# EAGLE board VCFA_v2 (EAGLE 9.4.2)
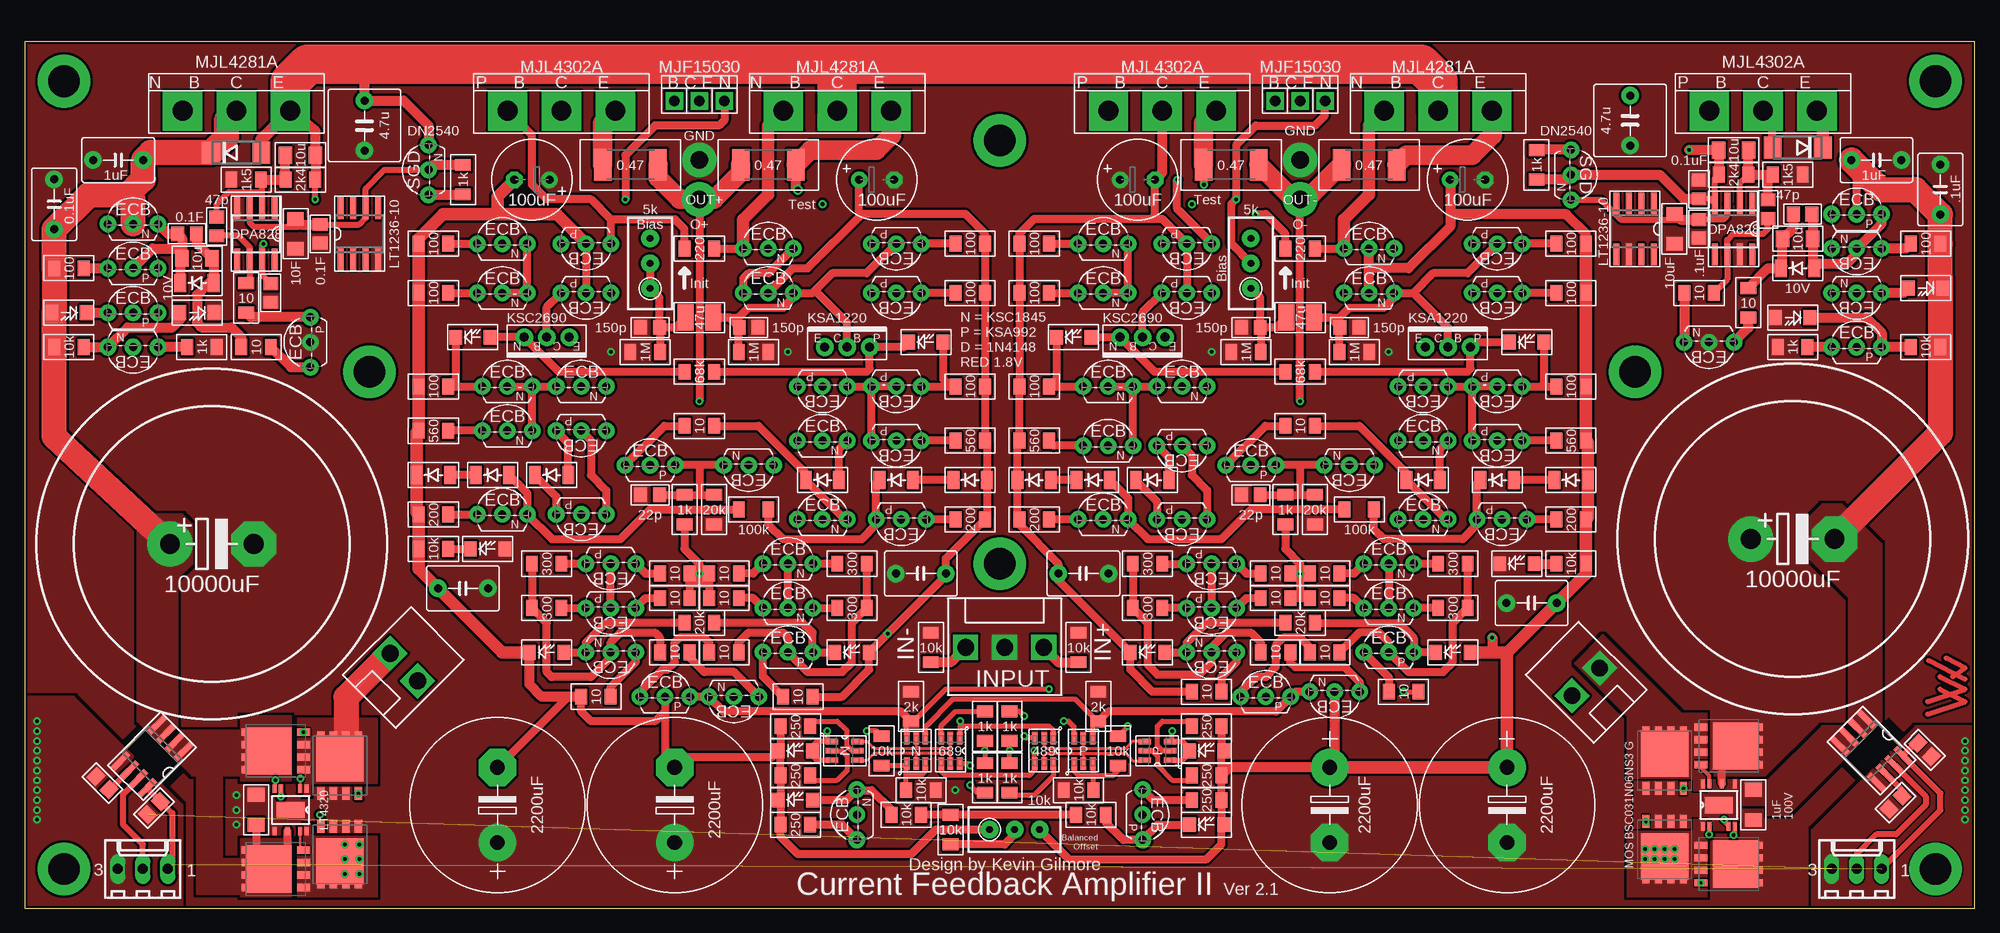
[diagram p4: board, top side]
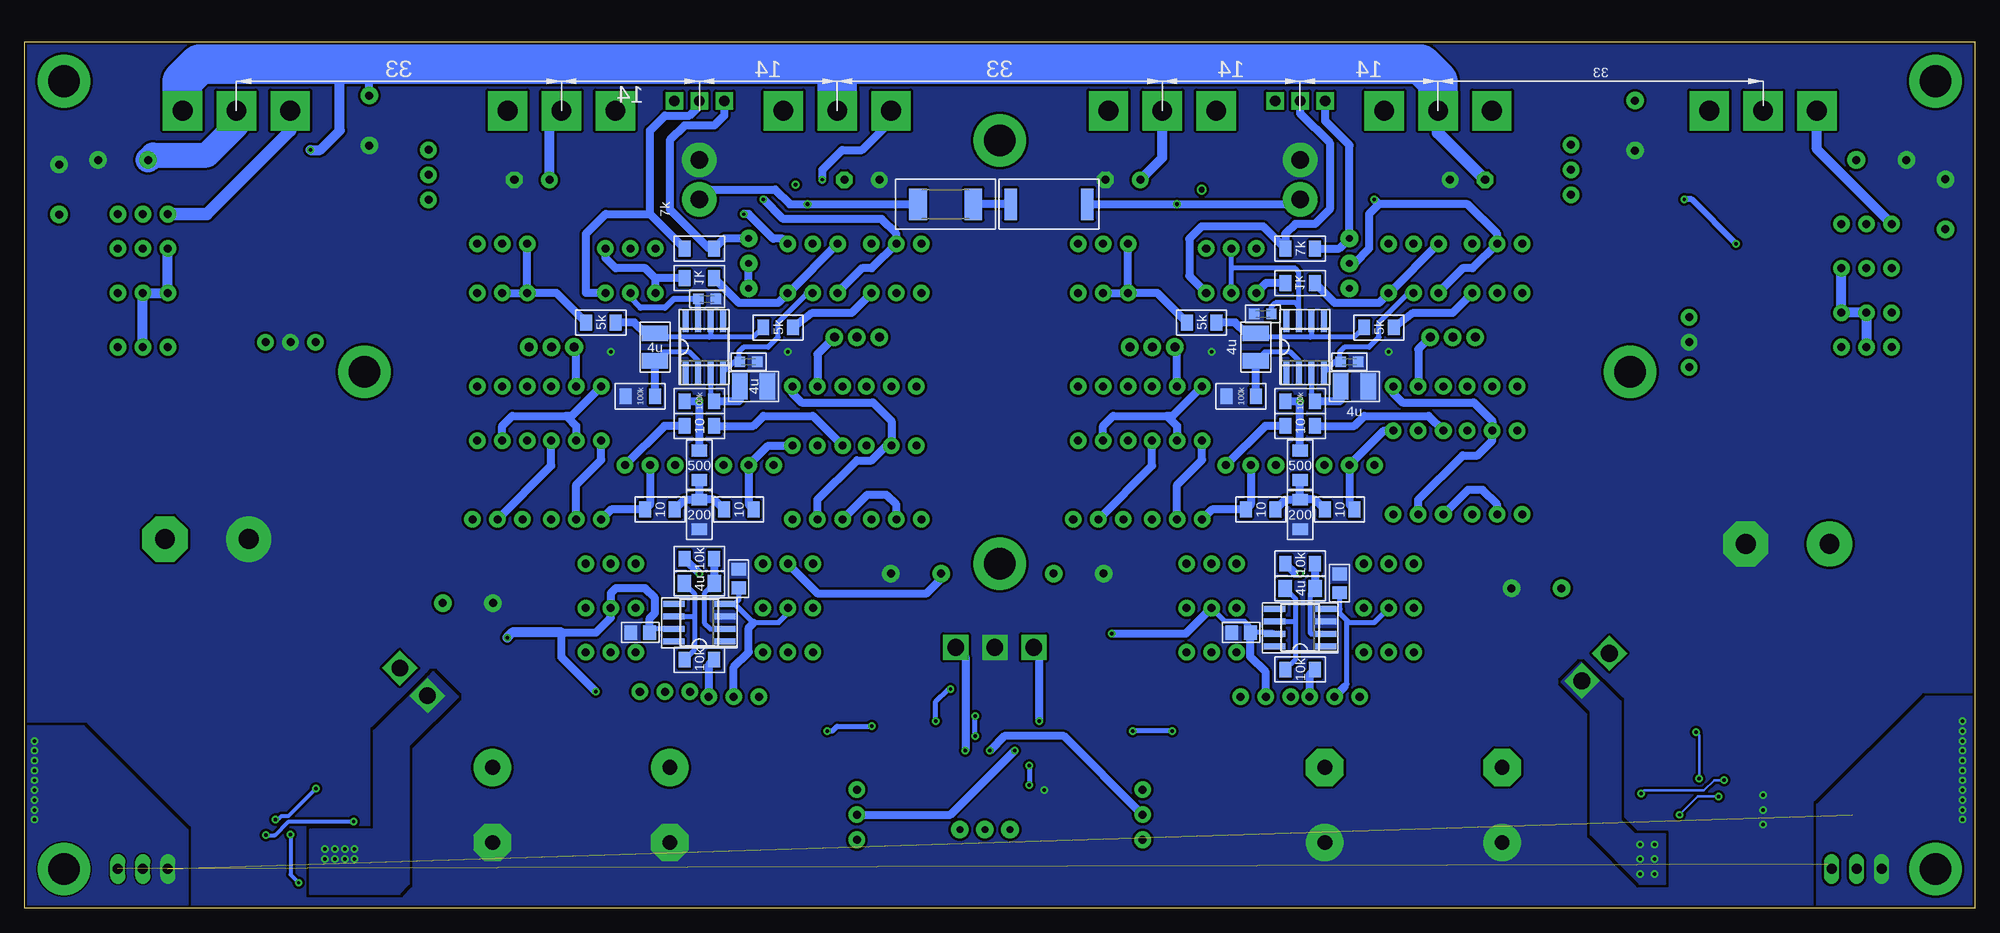
[diagram p5: board, bottom side, seen from below]

Size 198 x 88 mm. Coordinates in mm from the lower left corner, seen from the top.
Outline: 0,0 198,0 198,88 0,88 0,0
Copper layers (1*16): Top 0.035mm / dielectric 1.5mm / Bottom 0.035mm
Design rules "default *": minimum track width 6mil, minimum drill 0.35mm, track to track 6mil, track to pad 6mil, pad to pad 6mil, via to via 6mil, smd to smd 0mil, copper to edge 10mil, drill to drill 6mil, minimum pad ring 10mil, minimum via ring 8mil, stop-mask expansion 4mil, vias tented up to drill 0.35mm, thermal gap 3mil

## Footprints (pad centres in the part's own frame; a part is rotated, then mirrored left to right if it is on the bottom)
ECHU-Y = smd 1.277 x 3.2: 1 -3.9,0; 2 3.9,0
C0805 = smd 1.3 x 1.5: 1 -0.95,0; 2 0.95,0
E7,5-18 = drill 1.5 pad 3.81: + -3.81,0 | drill 1.5 pad 3.81 octagon: - 3.81,0
C050-045X075 = drill 0.813 pad 1.778: 1 -2.54,0; 2 2.54,0
C1206 = smd 1.4 x 1.7: 1 -1.527,0; 2 1.527,0
C1210 = smd 1.6 x 2.7: 1 -1.4,0; 2 1.4,0
C0603K = smd 1.05 x 1.08: 1 -0.875,0; 2 0.875,0
E3,5-8 = drill 0.813 pad 1.676: + -1.778,0 | drill 0.813 pad 1.676 octagon: - 1.778,0
EB35D-8.5 = drill 2.007 pad 4.597: + -4.25,0 | drill 2.007 pad 4.597 octagon: - 4.25,0
C050-075X075 = drill 0.813 pad 1.778: 1 -2.54,0; 2 2.54,0
SOD80C = smd 1.2 x 1.8: A 1.7,0; C -1.7,0
DO214AA = smd 1.8 x 2.2: A 2.55,0; C -2.55,0
SO8 = smd 0.6 x 2.2: 1 -1.905,-2.6; 2 -0.635,-2.6; 3 0.635,-2.6; 4 1.905,-2.6; 5 1.905,2.6; 6 0.635,2.6; 7 -0.635,2.6; 8 -1.905,2.6
M3_HOLE = drill 3.2 pad 5.334: P$1 0,0
SOIC8 = smd 0.6 x 2.2: 1 -1.905,-2.6; 2 -0.635,-2.6; 3 0.635,-2.6; 4 1.905,-2.6; 5 1.905,2.6; 6 0.635,2.6; 7 -0.635,2.6; 8 -1.905,2.6
6410-03 = drill 1.016 long: 1 2.54,0; 2 0,0; 3 -2.54,0
LED_SML1206 = smd 1.3 x 1.5: A 1.75,0; C -1.75,0
PAD-16 = drill 1.8 pad 3.5: P$1 0,0
SOT-23-6 = smd 1.27 x 0.559: 1 -1.295,0.95; 2 -1.295,0; 3 -1.295,-0.95; 4 1.295,-0.95; 5 1.295,0; 6 1.295,0.95
TRANSISTOR_TO92-ECB_P = drill 0.813 pad 1.676: B 2.54,0; C 0,0; E -2.54,0
TRANSISTOR_TO92-ECB_N = drill 0.813 pad 1.676: B 2.54,0; C 0,0; E -2.54,0
TRANSISTOR_TO126_P = drill 0.9 pad 1.778: B 2.286,0; C 0,0; E -2.286,0
TRANSISTOR_TO126_N = drill 0.9 pad 1.778: B 2.286,0; C 0,0; E -2.286,0
TRANSISTOR_TO220_BCE_N = drill 1.1 pad 1.778 square: B -2.54,0; C 0,0; E 2.54,0
TRANSISTOR_TO247_BCE_N = drill 2 pad 4 square: B -5.461,0; C 0,0; E 5.461,0
TRANSISTOR_TO247_BCE_P = drill 2 pad 4 square: B -5.461,0; C 0,0; E 5.461,0
TRANSISTOR_TO92-SGD_N = drill 0.813 pad 1.676: D 2.54,0; G 0,0; S -2.54,0
PG-TDSON-8 = smd 1.3 x 0.75: 1 -2.825,1.905; 2 -2.825,0.635; 3 -2.825,-0.635; 4 -2.825,-1.905; 5 2.825,-1.905; 6 2.825,-0.635; 7 2.825,0.635; 8 2.825,1.905 | smd 4.7 x 4.8: TH 0.725,0
RTRIM3296W = drill 0.7 pad 1.778: 1 0,-2.54; 2 0,0; 3 0,2.54
MINI_MELF-0204W = smd 1.2 x 1.6: 1 -1.5,0; 2 1.5,0
R2512 = smd 1.8 x 3.2: 1 -2.8,0; 2 2.8,0
LT4320_MSOP = smd 0.9 x 0.42: 1 -2.163,1.625; 2 -2.163,0.975; 5 -2.163,-0.975; 6 -2.163,-1.625; 7 2.15,-1.625; 9 2.15,-0.325; 11 2.15,0.975; 12 2.15,1.625 | smd 1.65 x 2.85: EXP 0,0
KK-156-3 = drill 1.7 pad 2.54 square: 1 -3.96,0; 2 0,0; 3 3.96,0
KK-156-2 = drill 1.7 pad 2.54 square: 1 -1.98,0; 2 1.98,0

## Placement (x,y rotation side)
C1  [ECHU-Y]  94,71.5 180 bottom
C3  0.1uF  [C0805]  74.5,28 0 bottom
C4  0.1uF  [C0805]  64.5,33 90 bottom
C5  1000uF  [E7,5-18]  132.5,10.5 270 top
C6  1000uF  [E7,5-18]  48,10.5 90 top
C7  1000uF  [E7,5-18]  150.5,10.5 270 top
C8  1000uF  [E7,5-18]  66,10.5 90 top
C9  0.1uF  [C050-045X075]  91,34 180 top
C10  0.1uF  [C050-045X075]  107.5,34 180 top
C11  0.1uF  [C050-045X075]  153,31 180 top
C12  0.1uF  [C050-045X075]  44.5,32.5 180 top
C13  10uF  [C1206]  68.5,32.5 0 bottom
C14  0.1uF  [C0805]  135.5,28 0 bottom
C15  0.1uF  [C0805]  125.5,33.5 90 bottom
C16  10uF  [C1206]  129.5,33 0 bottom
C17  22p  [C0805]  63.5,42 180 top
C18  47u  [C1210]  68.5,60 180 top
C19  150p  [C0805]  73.5,59 180 top
C20  150p  [C0805]  63.5,59 180 top
C21  4.7uF  [C1210]  73,57 270 bottom
C22  4.7uF  [C1210]  63,53 180 bottom
C23  0.1uF  [C0603K]  72.29,60.36 180 bottom
C24  0.1uF  [C0603K]  63.5,55.5 180 bottom
C25  100uF  [E3,5-8]  86.5,74 0 top
C26  100uF  [E3,5-8]  51.5,74 180 top
C27  22p  [C0805]  124.5,42 180 top
C28  47u  [C1210]  129.5,60 180 top
C29  150p  [C0805]  134.5,59 180 top
C30  150p  [C0805]  124.5,59 180 top
C31  4.7uF  [C1210]  134,57 270 bottom
C32  4.7uF  [C1210]  124,53 180 bottom
C33  0.1uF  [C0603K]  128.71,61.89 0 bottom
C34  0.1uF  [C0603K]  124.5,55.5 180 bottom
C35  100uF  [E3,5-8]  146.5,74 0 top
C36  100uF  [E3,5-8]  113,74 0 top
C37  10000uF  [EB35D-8.5]  19,37 0 top
C38  10000uF  [EB35D-8.5]  179.5,37.5 0 top
C39  0.1uF  [C050-045X075]  188,76 0 top
C40  10uF  [C1206]  17.5,66 0 top
C41  10uF  [C1206]  180,68 0 top
C42  0.1uF  [C050-045X075]  9.5,76 0 top
C43  0.1uF  [C0805]  16.5,68.5 0 top
C44  0.1uF  [C0805]  180.5,70.5 0 top
C45  0.1uF  [C0805]  25,62.5 90 top
C46  0.1uF  [C0805]  170,73 90 top
C47  10uF  [C1206]  27.5,68.5 270 top
C48  10uF  [C1206]  167.5,69 90 top
C49  0.1uF  [C0805]  30,68.5 270 top
C50  0.1uF  [C0805]  170,69 90 top
C51  47p  [C0805]  19.5,69.25 90 top
C52  47p  [C0805]  177,71 90 top
C53  10uF  [C1206]  28,76.5 180 top
C54  10uF  [C1206]  173.5,77 180 top
C55  4.7uF  [C050-075X075]  34.5,79.5 90 top
C56  4.7uF  [C050-075X075]  163,80 270 top
C57  47uF  [C1206]  23.5,10 90 top
C58  0.1uF  [C050-045X075]  3,71.5 270 top
C59  47uF  [C1206]  175.5,10.5 90 top
C60  0.1uF  [C050-045X075]  194.5,73 90 top
C61  [C0805]  13.13,10.18 225 top
C62  [C0805]  189.95,10.73 225 top
C63  1n  [C0805]  7.91,12.73 135 top
C64  [C0805]  192.9,16.09 315 top
D1  LL4148  [SOD80C]  96,43.5 0 top
D2  LL4148  [SOD80C]  88.5,43.5 0 top
D3  LL4148  [SOD80C]  47.5,44 0 top
D4  LL4148  [SOD80C]  41.5,44 0 top
D5  LL4148  [SOD80C]  81,43.5 0 top
D6  LL4148  [SOD80C]  53.5,44 0 top
D7  LL4148  [SOD80C]  157,43.5 0 top
D8  LL4148  [SOD80C]  149.5,43.5 0 top
D9  LL4148  [SOD80C]  108.5,43.5 0 top
D10  LL4148  [SOD80C]  102.5,43.5 0 top
D11  LL4148  [SOD80C]  142,43.5 0 top
D12  LL4148  [SOD80C]  114.5,43.5 0 top
D13  BZT55B10  [SOD80C]  17.5,63.5 0 top
D14  BZT55B10  [SOD80C]  180,65 0 top
D15  S1G  [DO214AA]  21.5,76.75 0 top
D16  S1G  [DO214AA]  180,77.25 180 top
D17  LT1236-10  [SO8]  34,68.5 0 top
D18  LT1236-10  [SO8]  163.5,69 180 top
H1  HOLE  [M3_HOLE]  4,4 0 top
H2  HOLE  [M3_HOLE]  194,4 0 top
H3  HOLE  [M3_HOLE]  4,84 0 bottom
H4  HOLE  [M3_HOLE]  194,84 0 top
H5  HOLE  [M3_HOLE]  35,54.5 0 top
H6  HOLE  [M3_HOLE]  99,35 0 top
H7  HOLE  [M3_HOLE]  163.5,54.5 0 top
H8  HOLE  [M3_HOLE]  99,78 0 top
IC1  LTC2057HV  [SOIC8]  68.5,28.5 90 bottom
IC2  LTC2057HV  [SOIC8]  129.5,29 90 bottom
IC3  LTC2057HV  [SOIC8]  68,57 0 bottom
IC4  LTC2057HV  [SOIC8]  129,57 0 bottom
IC5  OPA827  [SOIC8]  173.5,69 180 top
IC6  OPA827  [SOIC8]  23.5,68.5 180 top
J1  22-27-2031-03  [6410-03]  12,4 0 top
J2  22-27-2031-03  [6410-03]  186,4 0 top
LED1  RED  [LED_SML1206]  120,8.5 0 top
LED2  RED  [LED_SML1206]  78.25,11 0 top
LED3  RED  [LED_SML1206]  120,16 0 top
LED4  RED  [LED_SML1206]  78.25,16 0 top
LED5  RED  [LED_SML1206]  84,26 0 top
LED6  RED  [LED_SML1206]  53,26 0 top
LED7  RED  [LED_SML1206]  145,26 0 top
LED8  RED  [LED_SML1206]  114,26 0 top
LED9  RED  [LED_SML1206]  91.5,57.5 0 top
LED10  RED  [LED_SML1206]  45.5,58 0 top
LED11  RED  [LED_SML1206]  152.5,57.5 0 top
LED12  RED  [LED_SML1206]  106.5,58 0 top
LED13  RED  [LED_SML1206]  17.5,60.5 180 top
LED14  RED  [LED_SML1206]  179.5,60 180 top
LED15  RED  [LED_SML1206]  4.5,60.5 180 top
LED16  RED  [LED_SML1206]  193,63 180 top
LED17  RED  [LED_SML1206]  151.5,35 0 top
LED18  RED  [LED_SML1206]  47,36.5 0 top
PAD1  PAD  [PAD-16]  68.5,72 0 top
PAD2  PAD  [PAD-16]  129.5,72 0 top
PAD3  PAD  [PAD-16]  129.5,76 0 top
PAD4  PAD  [PAD-16]  68.5,76 0 top
Q1  LSK689  [SOT-23-6]  94,16 270 top
Q2  KSA992  [TRANSISTOR_TO92-ECB_P]  113.5,9.5 270 top
Q3  KSC1845  [TRANSISTOR_TO92-ECB_N]  84.5,9.5 90 top
Q4  LSK489  [SOT-23-6]  103.5,16 270 top
Q5  LS3550  [SOT-23-6]  107.5,16 90 top
Q6  LS3250  [SOT-23-6]  90.5,16 90 top
Q7  LS3250  [SOT-23-6]  83.25,16 0 top
Q8  LS3550  [SOT-23-6]  115,16 180 top
Q9  KSC1845  [TRANSISTOR_TO92-ECB_N]  72,21.5 180 top
Q10  KSA992  [TRANSISTOR_TO92-ECB_P]  65,21.5 0 top
Q11  KSA992  [TRANSISTOR_TO92-ECB_P]  77.5,26 0 top
Q12  KSC1845  [TRANSISTOR_TO92-ECB_N]  59.5,26 180 top
Q13  KSC1845  [TRANSISTOR_TO92-ECB_N]  77.5,35 0 top
Q14  KSA992  [TRANSISTOR_TO92-ECB_P]  59.5,35 180 top
Q15  KSC1845  [TRANSISTOR_TO92-ECB_N]  77.5,30.5 0 top
Q16  KSA992  [TRANSISTOR_TO92-ECB_P]  59.5,30.5 180 top
Q17  KSC1845  [TRANSISTOR_TO92-ECB_N]  133,22 180 top
Q18  KSA992  [TRANSISTOR_TO92-ECB_P]  126,21.5 0 top
Q19  KSA992  [TRANSISTOR_TO92-ECB_P]  138.5,26 0 top
Q20  KSC1845  [TRANSISTOR_TO92-ECB_N]  120.5,26 180 top
Q21  KSC1845  [TRANSISTOR_TO92-ECB_N]  138.5,35 0 top
Q22  KSA992  [TRANSISTOR_TO92-ECB_P]  120.5,35 180 top
Q23  KSC1845  [TRANSISTOR_TO92-ECB_N]  138.5,30.5 0 top
Q24  KSA992  [TRANSISTOR_TO92-ECB_P]  120.5,30.5 180 top
Q25  KSA992  [TRANSISTOR_TO92-ECB_P]  89,39.5 180 top
Q26  KSA992  [TRANSISTOR_TO92-ECB_P]  63.5,45 0 top
Q27  KSC1845  [TRANSISTOR_TO92-ECB_N]  73.5,45 180 top
Q28  KSC1845  [TRANSISTOR_TO92-ECB_N]  48.5,40 0 top
Q29  KSC1845  [TRANSISTOR_TO92-ECB_N]  81,47.5 0 top
Q30  KSC1845  [TRANSISTOR_TO92-ECB_N]  81,39.5 0 top
Q31  KSA992  [TRANSISTOR_TO92-ECB_P]  56.5,48.5 180 top
Q32  KSA992  [TRANSISTOR_TO92-ECB_P]  56.5,40 180 top
Q33  KSA992  [TRANSISTOR_TO92-ECB_P]  88.5,47.5 180 top
Q34  KSC1845  [TRANSISTOR_TO92-ECB_N]  49,48.5 0 top
Q35  KSA992  [TRANSISTOR_TO92-ECB_P]  88.5,53 180 top
Q36  KSA992  [TRANSISTOR_TO92-ECB_P]  81,53 180 top
Q37  KSC1845  [TRANSISTOR_TO92-ECB_N]  56.5,53 0 top
Q38  KSC1845  [TRANSISTOR_TO92-ECB_N]  49,53 0 top
Q39  KSA1220  [TRANSISTOR_TO126_P]  83.5,57 0 top
Q40  KSC2690  [TRANSISTOR_TO126_N]  53,58 180 top
Q41  KSA992  [TRANSISTOR_TO92-ECB_P]  88.5,62.5 180 top
Q42  KSC1845  [TRANSISTOR_TO92-ECB_N]  48.5,62.5 0 top
Q43  KSA992  [TRANSISTOR_TO92-ECB_P]  88.5,67.5 180 top
Q44  KSC1845  [TRANSISTOR_TO92-ECB_N]  48.5,67.5 0 top
Q45  MJE15030  [TRANSISTOR_TO220_BCE_N]  68.5,82 0 top
Q46  KSC1845  [TRANSISTOR_TO92-ECB_N]  75.5,62.5 0 top
Q47  KSA992  [TRANSISTOR_TO92-ECB_P]  57,62.5 180 top
Q48  KSC1845  [TRANSISTOR_TO92-ECB_N]  75.5,67 0 top
Q49  KSA992  [TRANSISTOR_TO92-ECB_P]  57,67.5 180 top
Q50  MJL4281A  [TRANSISTOR_TO247_BCE_N]  82.5,81 0 top
Q51  MJL4302A  [TRANSISTOR_TO247_BCE_P]  54.5,81 0 top
Q52  KSA992  [TRANSISTOR_TO92-ECB_P]  150,39.5 180 top
Q53  KSA992  [TRANSISTOR_TO92-ECB_P]  124.5,45 0 top
Q54  KSC1845  [TRANSISTOR_TO92-ECB_N]  134.5,45 180 top
Q55  KSC1845  [TRANSISTOR_TO92-ECB_N]  109.5,39.5 0 top
Q56  KSC1845  [TRANSISTOR_TO92-ECB_N]  142,47.5 0 top
Q57  KSC1845  [TRANSISTOR_TO92-ECB_N]  142,39.5 0 top
Q58  KSA992  [TRANSISTOR_TO92-ECB_P]  117.5,47 180 top
Q59  KSA992  [TRANSISTOR_TO92-ECB_P]  117.5,39.5 180 top
Q60  KSA992  [TRANSISTOR_TO92-ECB_P]  149.5,47.5 180 top
Q61  KSC1845  [TRANSISTOR_TO92-ECB_N]  110,47 0 top
Q62  KSA992  [TRANSISTOR_TO92-ECB_P]  149.5,53 180 top
Q63  KSA992  [TRANSISTOR_TO92-ECB_P]  142,53 180 top
Q64  KSC1845  [TRANSISTOR_TO92-ECB_N]  117.5,53 0 top
Q65  KSC1845  [TRANSISTOR_TO92-ECB_N]  110,53 0 top
Q66  KSA1220  [TRANSISTOR_TO126_P]  144.5,57 0 top
Q67  KSC2690  [TRANSISTOR_TO126_N]  113.5,58 180 top
Q68  KSA992  [TRANSISTOR_TO92-ECB_P]  149.5,62.5 180 top
Q69  KSC1845  [TRANSISTOR_TO92-ECB_N]  109.5,62.5 0 top
Q70  KSA992  [TRANSISTOR_TO92-ECB_P]  149.5,67.5 180 top
Q71  KSC1845  [TRANSISTOR_TO92-ECB_N]  109.5,67.5 0 top
Q72  MJE15030  [TRANSISTOR_TO220_BCE_N]  129.5,82 0 top
Q73  KSC1845  [TRANSISTOR_TO92-ECB_N]  136.5,62.5 0 top
Q74  KSA992  [TRANSISTOR_TO92-ECB_P]  118,62.5 180 top
Q75  KSC1845  [TRANSISTOR_TO92-ECB_N]  136.5,67 0 top
Q76  KSA992  [TRANSISTOR_TO92-ECB_P]  118,67.5 180 top
Q77  MJL4281A  [TRANSISTOR_TO247_BCE_N]  143.5,81 0 top
Q78  MJL4302A  [TRANSISTOR_TO247_BCE_P]  115.5,81 0 top
Q79  KSC1845  [TRANSISTOR_TO92-ECB_N]  11,57 180 top
Q80  KSA992  [TRANSISTOR_TO92-ECB_P]  186,57 0 top
Q81  KSA992  [TRANSISTOR_TO92-ECB_P]  11,60.5 0 top
Q82  KSC1845  [TRANSISTOR_TO92-ECB_N]  186,62.5 180 top
Q83  KSA992  [TRANSISTOR_TO92-ECB_P]  11,65 0 top
Q84  KSC1845  [TRANSISTOR_TO92-ECB_N]  186,67 180 top
Q85  KSA992  [TRANSISTOR_TO92-ECB_P]  29,57.5 90 top
Q86  KSC1845  [TRANSISTOR_TO92-ECB_N]  171,57.5 180 top
Q87  KSC1845  [TRANSISTOR_TO92-ECB_N]  11,69.5 0 top
Q88  KSA992  [TRANSISTOR_TO92-ECB_P]  186,70.5 0 top
Q89  MJL4281A  [TRANSISTOR_TO247_BCE_N]  21.5,81 0 top
Q90  MJL4302A  [TRANSISTOR_TO247_BCE_P]  176.5,81 0 top
Q91  DN2540  [TRANSISTOR_TO92-SGD_N]  41,75 90 top
Q92  DN2540  [TRANSISTOR_TO92-SGD_N]  157,74.5 270 top
Q97  MOS_SMDTDSON-8  [PG-TDSON-8]  25.5,16 180 top
Q98  MOS_SMDTDSON-8  [PG-TDSON-8]  25.5,4 180 top
Q99  MOS_SMDTDSON-8  [PG-TDSON-8]  32,5.5 270 top
Q100  MOS_SMDTDSON-8  [PG-TDSON-8]  32,14.5 90 top
Q105  MOS_SMDTDSON-8  [PG-TDSON-8]  173,4.5 0 top
Q106  MOS_SMDTDSON-8  [PG-TDSON-8]  173,16.5 0 top
Q107  MOS_SMDTDSON-8  [PG-TDSON-8]  166.5,15 90 top
Q108  MOS_SMDTDSON-8  [PG-TDSON-8]  166.5,6 270 top
R1  5k  [RTRIM3296W]  100.5,8 270 top
R2  10K  [MINI_MELF-0204W]  94,8 270 top
R3  10K  [MINI_MELF-0204W]  108.25,9.5 0 top
R4  10K  [MINI_MELF-0204W]  89.5,9.5 0 top
R5  250  [MINI_MELF-0204W]  120,11 0 top
R6  1K  [MINI_MELF-0204W]  97.5,18.5 270 top
R7  250  [MINI_MELF-0204W]  78.25,8.5 0 top
R8  1K  [MINI_MELF-0204W]  97.5,13.25 90 top
R9  1K  [MINI_MELF-0204W]  100,18.5 90 top
R10  1K  [MINI_MELF-0204W]  100,13.25 270 top
R11  2k  [MINI_MELF-0204W]  90,20.5 270 top
R12  250  [MINI_MELF-0204W]  120,18.5 0 top
R13  250  [MINI_MELF-0204W]  78.25,18.5 0 top
R14  10K  [MINI_MELF-0204W]  111,16 90 top
R15  10K  [MINI_MELF-0204W]  107,12 0 top
R16  10K  [MINI_MELF-0204W]  91,12 0 top
R17  10K  [MINI_MELF-0204W]  87,16 270 top
R18  250  [MINI_MELF-0204W]  120,13.5 0 top
R19  250  [MINI_MELF-0204W]  78.25,13.5 0 top
R20  2k  [MINI_MELF-0204W]  109,20.5 270 top
R21  10K  [MINI_MELF-0204W]  68.5,24.25 0 bottom
R22  20K  [MINI_MELF-0204W]  68.5,29 0 top
R23  250  [MINI_MELF-0204W]  78.5,21.5 0 top
R24  10  [MINI_MELF-0204W]  71,26 180 top
R25  10  [MINI_MELF-0204W]  66,26 180 top
R26  250  [MINI_MELF-0204W]  58,21.5 0 top
R27  300  [MINI_MELF-0204W]  84,35 0 top
R28  300  [MINI_MELF-0204W]  53,35 0 top
R29  10K  [MINI_MELF-0204W]  68.5,35 0 bottom
R30  10  [MINI_MELF-0204W]  71,34 0 top
R31  10  [MINI_MELF-0204W]  66,34 0 top
R32  300  [MINI_MELF-0204W]  84,30.5 0 top
R33  300  [MINI_MELF-0204W]  53,30.5 0 top
R34  10  [MINI_MELF-0204W]  71,31.5 0 top
R35  10  [MINI_MELF-0204W]  66,31.5 0 top
R36  10K  [MINI_MELF-0204W]  129.5,25.25 0 bottom
R37  20K  [MINI_MELF-0204W]  129.5,29 0 top
R38  250  [MINI_MELF-0204W]  140,22 0 top
R39  10  [MINI_MELF-0204W]  132,26 180 top
R40  10  [MINI_MELF-0204W]  127,26 180 top
R41  250  [MINI_MELF-0204W]  120,22 0 top
R42  300  [MINI_MELF-0204W]  145,35 0 top
R43  300  [MINI_MELF-0204W]  114,35 0 top
R44  10K  [MINI_MELF-0204W]  129.5,35.5 0 bottom
R45  10  [MINI_MELF-0204W]  132,34 0 top
R46  10  [MINI_MELF-0204W]  127,34 0 top
R47  300  [MINI_MELF-0204W]  145,30.5 0 top
R48  300  [MINI_MELF-0204W]  114,30.5 0 top
R49  10  [MINI_MELF-0204W]  132,31.5 0 top
R50  10  [MINI_MELF-0204W]  127,31.5 0 top
R51  1k  [MINI_MELF-0204W]  67,40.5 270 top
R52  20k  [MINI_MELF-0204W]  70,40.5 90 top
R53  100k  [MINI_MELF-0204W]  74,40.5 0 top
R54  200  [MINI_MELF-0204W]  96,39.5 0 top
R55  10  [MINI_MELF-0204W]  68.5,49 0 top
R56  10  [MINI_MELF-0204W]  68.5,49 180 bottom
R57  200  [MINI_MELF-0204W]  41.5,40 0 top
R58  560  [MINI_MELF-0204W]  96,47.5 0 top
R59  10  [MINI_MELF-0204W]  72.5,40.5 180 bottom
R60  10  [MINI_MELF-0204W]  64.5,40.5 180 bottom
R61  560  [MINI_MELF-0204W]  41.5,48.5 0 top
R62  100  [MINI_MELF-0204W]  96,53 0 top
R63  200  [MINI_MELF-0204W]  68.5,40 90 bottom
R64  100  [MINI_MELF-0204W]  41.5,53 0 top
R65  68k  [MINI_MELF-0204W]  68.5,54.5 0 top
R66  500  [MINI_MELF-0204W]  68.5,45 90 bottom
R67  100  [MINI_MELF-0204W]  96,62.5 0 top
R68  5k  [MINI_MELF-0204W]  78.5,59.5 180 bottom
R69  5k  [MINI_MELF-0204W]  60.5,59 180 bottom
R70  100  [MINI_MELF-0204W]  41.5,62.5 0 top
R71  100  [MINI_MELF-0204W]  96,67.5 0 top
R72  100  [MINI_MELF-0204W]  41.5,67.5 0 top
R73  7k  [MINI_MELF-0204W]  68.5,67 180 bottom
R74  5k  [RTRIM3296W]  63.5,65.5 0 top
R75  1M  [MINI_MELF-0204W]  74,56.5 0 top
R76  1M  [MINI_MELF-0204W]  63,56.5 0 top
R77  1k  [MINI_MELF-0204W]  68.5,63.5 180 bottom
R78  220  [MINI_MELF-0204W]  68.5,67 0 top
R79  100k  [MINI_MELF-0204W]  74.5,52 0 bottom
R80  0.5  [R2512]  75.5,75.5 0 top
R81  0.5  [R2512]  61.5,75.5 0 top
R82  100k  [MINI_MELF-0204W]  68.5,51.5 0 bottom
R83  1k  [MINI_MELF-0204W]  128,40.5 270 top
R84  20k  [MINI_MELF-0204W]  131,40.5 90 top
R85  100k  [MINI_MELF-0204W]  135.5,40.5 0 top
R86  200  [MINI_MELF-0204W]  157,39.5 0 top
R87  10  [MINI_MELF-0204W]  129.5,49 0 top
R88  10  [MINI_MELF-0204W]  129.5,49 180 bottom
R89  200  [MINI_MELF-0204W]  102.5,39.5 0 top
R90  560  [MINI_MELF-0204W]  157,47.5 0 top
R91  10  [MINI_MELF-0204W]  133.5,40.5 180 bottom
R92  10  [MINI_MELF-0204W]  125.5,40.5 180 bottom
R93  560  [MINI_MELF-0204W]  102.5,47.5 0 top
R94  100  [MINI_MELF-0204W]  157,53 0 top
R95  200  [MINI_MELF-0204W]  129.5,40 90 bottom
R96  100  [MINI_MELF-0204W]  102.5,53 0 top
R97  68k  [MINI_MELF-0204W]  129.5,54.5 0 top
R98  500  [MINI_MELF-0204W]  129.5,45 90 bottom
R99  100  [MINI_MELF-0204W]  157,62.5 0 top
R100  5k  [MINI_MELF-0204W]  139.5,59.5 180 bottom
R101  5k  [MINI_MELF-0204W]  121.5,59 180 bottom
R102  100  [MINI_MELF-0204W]  102.5,62.5 0 top
R103  100  [MINI_MELF-0204W]  157,67.5 0 top
R104  100  [MINI_MELF-0204W]  102.5,67.5 0 top
R105  7k  [MINI_MELF-0204W]  129.5,67 180 bottom
R106  5k  [RTRIM3296W]  124.5,65.5 0 top
R107  1M  [MINI_MELF-0204W]  135,56.5 0 top
R108  1M  [MINI_MELF-0204W]  124,56.5 0 top
R109  1k  [MINI_MELF-0204W]  129.5,64 180 bottom
R110  220  [MINI_MELF-0204W]  129.5,67 0 top
R111  100k  [MINI_MELF-0204W]  135.5,52 0 bottom
R112  0.5  [R2512]  136.5,75.5 0 top
R113  0.5  [R2512]  122.5,75.5 0 top
R114  100k  [MINI_MELF-0204W]  129.5,51.5 0 bottom
R115  10k  [MINI_MELF-0204W]  4.5,57 0 top
R116  10k  [MINI_MELF-0204W]  193,57 0 top
R117  1k  [MINI_MELF-0204W]  18,57 0 top
R118  1k  [MINI_MELF-0204W]  179.5,57 0 top
R119  100  [MINI_MELF-0204W]  4.5,65 0 top
R120  10  [MINI_MELF-0204W]  23.5,57 0 top
R121  10  [MINI_MELF-0204W]  175,61.5 90 top
R122  100  [MINI_MELF-0204W]  193,67.5 0 top
R123  10  [MINI_MELF-0204W]  22.5,62 270 top
R124  10  [MINI_MELF-0204W]  170,62.5 180 top
R125  1k  [MINI_MELF-0204W]  44.5,74 270 top
R126  1k  [MINI_MELF-0204W]  153.5,75.5 90 top
R127  1.5k  [MINI_MELF-0204W]  28,74 0 top
R128  1.5k  [MINI_MELF-0204W]  22.5,74 0 top
R129  1.5k  [MINI_MELF-0204W]  179,74.5 0 top
R130  1.5k  [MINI_MELF-0204W]  173.5,74.5 0 top
R131  10k  [MINI_MELF-0204W]  157,35 0 top
R132  10k  [MINI_MELF-0204W]  41.5,36.5 0 top
R133  [R2512]  104.5,71.5 180 bottom
R134  10K  [MINI_MELF-0204W]  107,26.5 270 top
R135  10K  [MINI_MELF-0204W]  92,26.5 270 top
S1  VWV  [VWV]  197,22.25 90 top
U$1  ACHS-712X  [SO8]  12.94,15.44 135 top
U$2  LT4320MSOP  [LT4320_MSOP]  27,10 270 top
U$3  ACHS-712X  [SO8]  187.5,16 225 top
U$4  LT4320MSOP  [LT4320_MSOP]  172,10.5 90 top
X1  KK-156-3  [KK-156-3]  99.5,26.5 0 top
X2  [KK-156-2]  158.5,23 225 top
X3  [KK-156-2]  38.5,24.5 135 top

## Tracks (layer width: path | path; a pad name or v marks a point on that pad's centre or on a via)
AC1
  Top 2.54: X3.2 32.64,21.43 Q100.6
  pour Top (no thermals): 27.75,19.25 27.75,11.5 29,11.5 29,12.5 29.25,12.75 35.75,12.75 35.75,19.25
AC2  (via drill 0.35)
  Top 2.54: 32.77,4 Q99.TH
  other vias: 32.5,6.5 32.5,5 32.5,3.5 34,3.5 34,5 34,6.5
  pour Top (no thermals): 27.75,1.25 27.75,8.5 29,8.5 29,7.5 29.25,7.25 35.75,7.25 35.75,1.25
  pour Bottom (no thermals): 40,25 36,21 36,9 34.5,7.5 31.5,7.5 31.5,2.5 34,2.5 39,7.5 39,20 42,23
AC3  (via drill 0.35)
  other vias: 164.5,6 165.5,6 166.5,6 167.5,6 167.5,5 166.5,5 165.5,5 164.5,5
  pour Top (no thermals): 170.75,1.25 170.75,9 169.5,9 169.5,8 169.25,7.75 162.75,7.75 162.75,1.25
  pour Bottom (no thermals): 157,23.5 162.5,18 162.5,12 162.5,8.5 162.5,8 169,8 169,1.5 160,1.5 159,2.5 159,16.5 154,21.5 156.5,24
AC4
  pour Top (no thermals): 170.75,19.75 170.75,12 169.5,12 169.5,13 169.25,13.25 162.75,13.25 162.75,19.75
  pour Top (no thermals): 157.38,24.88 163,19.25 163,19 169,19 160.25,27.75
BOUT+  (via drill 0.35)
  Top 0.813: R31.2 67.5,33 | 67.5,33 R35.2 | R30.1 69.5,33 | 69.5,33 R34.1 | 67.5,33 68.5,33 | 68.5,33 69.5,33 | R51.2 67,36.5 68.5,35 v68.5,34 68.5,33
  Bottom 0.813: R29.1 69,34 v68.5,34
BOUT-  (via drill 0.35)
  Top 0.813: R46.2 v129.5,34 | v129.5,34 R45.1 | R50.2 129.5,31.5 | 129.5,31.5 R49.1 | v129.5,34 129.5,31.5 | R83.2 128,36.5 129.5,35 v129.5,34
  Bottom 0.813: R44.1 v129.5,34
D5V  (1 unrouted)
  Top 0.61: C61.1 12.45,12.21 U$1.8 | U$1.8 | C64.1 191.94,16.76 U$3.8 194.5,11.69 194.5,9.96 J2.1 | J1.1 15,4.46 15,9.66 C61.1 | C61.1
DGND  (via drill 0.35)  (1 unrouted)
  other vias: 197,9 197,10 197,11 197,13 197,12 197,14 197,15 197,16 197,17 1.25,9 1.25,10 1.25,11 1.25,12 1.25,13 1.25,14 1.25,15 1.25,16 1.25,17 1.25,18 1.25,19
  pour Top (no thermals): 181.5,8 192,18.5 198,18.5 198,0 181.5,0
  pour Bottom (no thermals): 181.5,8 192,18.5 198,18.5 198,0 181.5,0
  pour Bottom (isolate 0.254, no thermals): 0,21.5 5,21.5 16,10.5 16,0 0,0
  pour Top (isolate 0.254, no thermals): 0,21.5 5,21.5 16,10.5 16,0 0,0
GND  (via drill 0.35)
  Top 0.813: U$4.9 172.32,13.82
  other vias: 138.5,56.5 120.5,56.5 77.5,56.5 59.5,56.5 94.5,12 21.5,11.5 21.5,10 21.5,8.5
  pour Bottom (isolate 0.254, rank 6, no thermals): -0.5,93.99 197.94,93.99 197.94,-0.04 -0.5,-0.04
  pour Top (isolate 0.254, rank 6, no thermals): -0.5,93.99 197.94,93.99 197.94,-0.04 -0.5,-0.04
IN+  (via drill 0.35)
  Top 0.508: Q1.4 93.05,13.95 93.5,13.5 102,13.5 102.55,14.05 Q4.4 102.55,15.95 v102.5,16
  Top 1.016: X1.3 104.96,25 R134.2
  Bottom 0.813: X1.3 102.5,25.54 v102.5,16
IN-  (via drill 0.35)
  Top 0.508: Q4.1 104.45,18.05 104,18.5 95,18.5 | Q1.1 94.95,18.45 95,18.5 | 95,18.5 v95,19
  Top 1.016: X1.1 94.04,25 R135.2
  Bottom 0.813: X1.1 95,25.96 v95,19
N$1
  Bottom 1.016: Q79.C Q81.C Q81.B Q83.B
N$2
  Top 0.508: Q8.2 115.5,16 115,16.5 115,18.5 115.5,19 118,19 R12.1
N$3
  Top 0.813: R54.1 Q25.E
N$4
  Top 0.813: R24.2 69.5,27 69,27.5 66.5,27.5 66,27 66,25 65.25,24.25 64.75,24.25 62.46,21.96 Q10.E
N$5
  Top 0.813: R26.2 59.5,22.5 62.04,25.04 Q12.E
N$6
  Top 0.813: R23.1 74.96,23.54 Q11.E
N$7
  Top 0.813: LED5.C Q11.B 80,26.04 80,28 79,29 R22.2
N$8
  Top 0.813: R22.1 59,29 56.96,26.96 Q12.B LED6.A
N$9
  Top 0.813: R24.1 72.5,27 73.5,28 77,28 77.5,27.5 Q11.C 79.5,24 83,24 84,25 84,29 R32.2 R27.2
N$10
  Top 0.813: R25.2 64.5,27.5 64,28 60.5,28 59.5,27 Q12.C 59.5,25.5 57.5,23.5 53.5,23.5 53,24 53,29 R33.1 R28.1
N$11
  Top 0.813: Q9.E 72.04,24 69,24 67.5,25.5 R25.1
N$12
  Top 0.813: D5.A 82.7,46.66 Q29.B
  Bottom 0.813: Q25.C 83.54,44.96 Q29.B
N$13
  Top 0.813: R27.1 Q13.B
N$14
  Top 0.813: Q13.E 73.96,34 R30.2
N$15
  Top 0.813: R33.2 Q16.B
N$16
  Top 0.813: Q15.B R32.1
N$17
  Top 0.813: Q14.B R28.2
N$18
  Top 0.813: Q14.E 63.04,34 R31.1
N$19
  Bottom 0.508: C13.2 67.5,31.97 67.5,28 67.36,27.86 IC1.2
  Bottom 0.813: R29.2 67,32.53 C13.2
N$20
  Top 0.813: Q15.E 73.96,31.5 R34.2
N$21
  Top 0.813: Q16.E 63.04,31.5 R35.1
N$22
  Bottom 0.508: C13.1 69,31.47 69,29 | R21.1 69,25.25 69,29 | IC1.6 69.14,29.14 69,29
N$23
  Top 0.508: Q8.5 114.5,16 115,15.5 115,14.5 116.5,13 118.5,13 R18.1
N$24
  Top 0.813: R4.2 R2.1 R3.1
N$25
  Top 0.813: D1.C D2.A
N$26
  Top 0.813: D2.C 86.46,43.16 Q25.B 86.46,38.96 85,37.5 77,37.5 75.5,39 R53.2
N$27
  Top 0.813: R55.2 74.5,49 79.3,44.2 D5.C 83.3,39.5 Q30.B
N$28
  Bottom 0.813: Q29.E 78.46,45.54 81,43 Q30.C
N$29
  Bottom 0.813: Q27.C 73.5,41 R59.2 77.46,40.5 Q30.E
N$30
  Bottom 0.813: R60.2 67,41.5 R63.2 | R59.1 70,41.5 R63.2 | R63.2 R66.1
N$31
  Bottom 0.813: R60.1 63.5,41 Q26.C 60,48.5 Q31.E
N$32
  Top 0.813: D6.A 55.2,47.26 Q31.B
  Bottom 0.813: R56.1 63,49 62,50 55.46,50 Q31.B
N$33
  Top 0.813: D6.C 53.96,41.84 Q32.B
  Bottom 0.813: Q28.C 48.5,41 50,42.5 51.46,42.5 Q32.B
N$34
  Top 0.813: R57.2 Q28.E
N$35
  Top 0.813: D3.C D4.A
N$36
  Top 0.813: Q31.C 57.5,47.5 57.5,44 59.04,42.46 Q32.E
N$37
  Top 0.813: Q26.E 64.96,49 R55.1
N$38
  Bottom 0.813: R56.2 72.04,49 Q27.E
N$39
  Top 0.813: 68.5,42 R51.1 C17.1 | 68.5,42 R52.2 | Q27.B 68.5,45 | 68.5,45 Q26.B | 68.5,45 68.5,42
N$40
  Bottom 0.813: Q33.C 88.5,49 87.5,50 82,50 | 82,50 81,49 Q29.C | Q36.B 81.46,50 82,50
N$41
  Top 0.813: Q33.B Q35.B | Q35.C Q35.B | Q36.E Q35.B
N$42
  Top 0.813: R58.1 Q33.E
N$43
  Top 0.813: Q20.E 123.04,25.04 121.5,23.5 R41.2
N$44
  Top 0.813: Q19.E 138.5,23.46 R38.1
N$45
  Top 0.813: R37.2 139.5,29 141.04,27.46 Q19.B LED7.C
N$46
  Top 0.813: LED8.A Q20.B 117.96,26.96 120,29 R37.1
N$47
  Top 0.813: R39.1 135.5,28 137.5,28 138.5,27 Q19.C 140.5,24 144,24 145,25 145,29 R47.2 R42.2
N$48
  Top 0.813: R43.1 R48.1 114,29 114,24.75 115,23.75 119.25,23.75 120.5,25 Q20.C 120.5,26.5 122,28 124.5,28 125.5,27 R40.2
N$49
  Top 0.813: R39.2 130.5,26.5 129.5,27.5 127.81,27.5 127,26.69 127,24.5 126,23.5 125,23.5 123.46,21.96 Q18.E
N$50
  Top 0.813: Q17.E 135.54,22.96 134,24.5 129,24.5 128.5,25 R40.1
N$51
  Top 0.813: Q35.E 94,53 | 94,53 R62.1 | 94,53 93.25,53.75 LED9.A
N$52
  Top 0.813: R42.1 Q21.B
N$53
  Top 0.813: R43.2 Q22.B
N$54
  Top 0.813: R47.1 Q23.B
N$55
  Top 0.813: Q24.B R48.2
N$56
  Top 0.813: Q21.E 134.96,34 R45.2
N$57
  Top 0.813: Q22.E 124.04,34 R46.1
N$58
  Top 0.813: Q23.E 134.96,31.5 R49.2
N$59
  Top 0.813: Q24.E 124.04,31.5 R50.1
N$60
  Bottom 0.508: C16.2 129,31.97 129,29 128.37,28.36 IC2.2
  Bottom 0.813: R44.2 128,33.03 C16.2
N$61
  Bottom 0.508: C16.1 130,31.97 130,29.5 | R36.1 130,26.25 130,29.5 | IC2.6 130.13,29.64 130,29.5
N$62
  Bottom 0.813: Q36.C 81,56.79 Q39.E
N$63
  Top 0.813: LED9.C 89.25,57 Q39.B 85.79,54.79 85.5,54.5 R65.2
N$64
  Top 0.813: Q34.B Q38.B | Q38.C Q38.B | Q38.B Q37.E
N$65
  Top 0.813: R64.2 43.5,53 | 43.5,53 Q38.E | LED10.C 43.75,53.25 43.5,53
N$66
  Top 0.813: Q34.E R61.2
N$67
  Bottom 0.813: Q32.C 56.5,41.5 52,46 50.5,46 49,47.5 Q34.C 49,49.5 50.88,51.38 58.14,51.38 59.04,52.29 Q37.B
N$68
  Bottom 0.813: Q40.E 56.5,56.79 Q37.C
N$69
  Top 0.813: R65.1 54.21,54.5 Q40.B LED10.A
N$70
  Top 0.813: R75.1 72.5,58.95 C19.2 71.55,60 C18.1 72.5,60 73.5,61 77,61 78.04,62.04 Q46.B 80,62.5 80.25,62.75 | Q43.C 85.5,64.5 82,64.5 80.25,62.75 | Q39.C 83.5,59.5 80.25,62.75
  Bottom 0.813: Q45.C 68.5,80.75 65.5,77.75 65.5,71 67,69.5 69,69.5 70,68.5 R73.2 72.25,69.25 78.5,69.25 79.75,68 79.75,64.21 Q46.B
N$71
  Bottom 0.813: R68.2 83,62.5 Q41.B | Q41.C Q41.B | Q41.B Q43.B
N$72
  Top 0.813: Q42.C Q42.B Q44.B
  Bottom 0.813: R69.1 57,60.5 53,60.5 51.04,62.46 Q42.B
N$73
  Top 0.813: R67.1 Q41.E
N$74
  Top 0.813: R71.1 Q43.E
N$75
  Top 1.016: LED15.C Q81.E
N$76
  Top 0.813: R70.2 Q42.E
N$77
  Top 0.813: R72.2 Q44.E
N$78
  Top 0.813: Q48.B 75.54,64.5 73.5,64.5 72.96,63.96 Q46.E
  Bottom 0.813: R77.2 71.96,63.5 Q46.E
N$79
  Bottom 0.813: Q49.B 59.46,62.5 | 59.46,62.5 Q47.E | R77.1 65,61.5 60.46,61.5 59.46,62.5
N$80  (via drill 0.35)
  Top 0.813: R74.2 R74.1 64.45,62.01 C20.1 | C20.1 64.5,58.95 R76.2 | C18.2 66.1,59 C20.1 | Q40.C 53,61.04 Q47.B | Q45.E 71.04,80.04 70.5,79.5 64,79.5 61,76.5 v61,72
  Bottom 0.813: Q47.B 54.46,62.54 52,65 51,65 Q44.C 48.5,68.5 51.5,71.5 60.5,71.5 | R74.2 63,65.5 61.5,67 61.5,70.5 60.5,71.5 | v61,72 60.5,71.5
N$81
  Top 0.813: R78.2 Q48.E
  Top 1.27: Q50.B 75.5,79.46 75.5,72.5 72.96,69.96 Q48.E
N$82
  Top 0.813: R78.1 67,69 66.04,69.96 59.54,69.96 | Q49.E 59.54,69.96 | 59.54,69.96 57.5,72 53,72 51.5,73.5 51.5,78.54 Q51.B
N$83  (via drill 0.6)
  Top 1.016: v78.5,73 78.3,73.2 R80.2
  Top 2: R80.2 79.8,77 86.5,77 88,78.5 88,80.96 Q50.E
N$84
  Top 2: R81.1 58.7,79.74 Q51.E
N$85
  Bottom 0.508: IC3.2 68.64,55.63 69.5,56.5 72.1,56.5 72.8,55.8
  Bottom 0.813: R79.2 C21.2 72.8,55.8
N$86
  Bottom 0.508: IC3.3 67.36,51.87 R82.2
  Bottom 0.813: R82.2 64.5,51.5 64.4,51.6 C22.2
N$87
  Top 0.813: D3.A 51.04,42.16 Q28.B 53.54,37.5 60.5,37.5 63.5,40.5 R53.1
N$88
  Bottom 0.813: R73.1 64.54,67 R74.3 63.5,77.5 65.96,79.96 Q45.B
N$89
  Bottom 0.508: C21.1 72.6,58 67.5,58 | IC3.6 67.36,58.13 67.5,58 | R69.2 63,58 67.5,58
  Bottom 0.813: C21.1 74,58.4 75.1,59.5 R68.1
N$90
  Top 1.016: R119.2 Q83.E
N$91
  Top 0.61: U$3.6 190.63,11.98 C62.1
N$92
  Top 0.813: R1.2 100.5,7.5 99.5,6.5 R2.2
N$93
  Top 0.508: Q7.5 84,16 83.5,16.5 83.5,18 82.5,19 79.75,19 R13.2
N$94
  Top 0.508: Q7.2 83,16 83.5,15.5 83.5,14 82.5,13 79.75,13 R19.2
N$95
  Top 0.305: Q1.5 94,15.75 90.75,15.75 | 90.75,15.75 90.5,15.5 Q6.2 | 90.75,15.75 86.25,15.75 85.5,15 84.59,15 Q7.4
N$96
  Top 0.305: Q6.5 90.5,16.5 90.75,16.25 | 90.75,16.25 94,16.25 Q1.2 | Q7.6 85.55,16.95 86.25,16.25 90.75,16.25
N$97  (via drill 0.35)
  Top 0.508: Q7.3 80.45,15.05 80,15.5 LED4.A 80,16.5 80.45,16.95 81.5,16.95 | Q7.1 81.5,16.95 | R17.1 86.5,18 v85.5,18 | 81.5,16.95 v81.5,18
  Bottom 0.508: v81.5,18 v85.5,18
N$98
  Top 0.508: R16.1 89.5,13.5 | 89.5,13.5 89.5,14.65 | 89.5,14.65 Q6.1 | Q6.3 91.45,13.95 91,13.5 89.5,13.5 | R17.2 89.34,14.5 89.5,14.65
N$99
  Top 0.813: LED2.A 83.46,11 Q3.B 84.54,12 86,12 88,10 R4.1
N$100
  Top 1.016: D13.C 15.8,65.83 C40.1 15.97,67 | 15.97,67 15.97,68.08 C43.1 14.54,68.5 Q87.B | Q83.C 13,67 15.97,67
N$101
  Top 0.508: Q5.1 106.55,13.95 107,13.5 108.5,13.5 | 108.5,13.5 110.5,13.5 111,14 R14.1 | Q5.3 108.45,13.55 108.5,13.5 | R15.2 108.5,13.5
N$102
  Top 0.305: Q4.2 103.5,16.5 103.75,16.25 107.25,16.25 | 107.25,16.25 107.5,16.5 Q5.5 | 107.25,16.25 111.75,16.25 112.5,17 113.66,17 Q8.4
N$103  (via drill 0.35)
  Top 0.508: Q8.1 117.55,15.05 118.25,15.75 LED3.C 118.25,16.25 117.55,16.95 Q8.3 116.5,17.16 v116.5,18 | R14.2 v112,18.5
  Bottom 0.508: v116.5,18 116,18 115.5,18.5 v112,18.5
N$104
  Top 0.305: Q4.5 103.5,15.5 103.75,15.75 107.25,15.75 | 107.25,15.75 107.5,15.5 Q5.2 | 107.25,15.75 111.75,15.75 112.5,15 113.66,15 Q8.6
N$105
  Top 1.016: C43.2 17.45,67.58 C40.2 19.2,65.83 D13.A 18.7,63.5 17.5,62.3 17.5,59.5 18,59 21,59 22,58 R120.1
N$106
  Top 1.016: R120.2 27.04,54.96 Q85.E
N$107
  Top 1.016: R117.1 Q79.E
N$108
  Top 0.813: LED1.C 115.04,8.5 Q2.B 111.54,6.96 109.75,8.75 R3.2
N$109
  Top 0.813: Q2.E 114.54,11 R5.1
N$110  (via drill 0.35)
  Top 0.508: R6.2 v97.5,16 R8.2
  Bottom 0.813: Q2.C 104,9.5 v97.5,16
N$111  (via drill 0.35)
  Top 0.305: 96.75,11.75 R8.1
  Top 0.508: Q1.6 95.8,14.71 v96,14.5 | v96,12.5 96.75,11.75
  Bottom 0.508: v96,14.5 v96,12.5
N$112
  Top 0.508: Q1.3 93.05,18.55 94.5,20 R6.1
N$113
  Top 1.016: LED13.A 15.75,59.75 15,59 10.46,59 Q79.B R115.2
N$114
  Top 1.016: Q80.E R118.2
N$115  (via drill 0.35)
  Top 0.508: Q4.3 101.7,17.3 v101.5,17.5 | v101.5,19.5 101,20 R9.2
  Bottom 0.508: v101.5,17.5 v101.5,19.5
N$116
  Top 0.305: 100.25,11.5 R10.2
  Top 0.508: Q4.6 104.45,13.45 102.5,11.5 100.25,11.5
N$117  (via drill 0.35)
  Top 0.508: R10.1 v100,16 R9.1
  Bottom 0.813: Q3.C 92.5,17.5 98.5,17.5 v100,16
N$118
  Top 0.813: Q3.E 83,8.46 83,8.5 R7.2
N$119
  Top 1.016: LED14.C 187,60 188.54,58.46 Q80.B R116.1
N$120
  Top 1.016: Q86.E 175,58.96 R121.1
N$121
  Top 1.016: R121.2 177,65 D14.C 178.47,65.17 C41.1 179.55,69.08 C44.1
N$122
  Top 1.016: C44.2 181.53,70.42 C41.2 181.53,65.17 D14.A 182.2,65.5 185,65.5 186,66.5 Q84.C 188.54,69.54 Q88.B
N$123
  Bottom 1.016: Q80.C Q82.C Q82.B Q84.B
N$124
  Top 1.016: R122.1 191,67 Q84.E
N$125
  Top 1.016: LED16.A 190.75,62.5 Q82.E
N$126
  Bottom 1.27: Q90.B 171.04,79 179.54,70.5 Q88.E
N$127
  Bottom 1.016: Q87.E 16.04,77.08 Q89.B
N$128
  Top 0.61: R123.1 22.86,63.87 IC6.6 22.86,67.14 21.7,68.3 C51.1
N$129
  Top 0.61: R124.1 172.87,63.87 IC5.6 172.87,67.86 173.5,68.5 176.5,68.5 177,69 C52.1
N$130
  Top 1.016: R124.2 168.5,57.54 Q86.B
N$131
  Top 1.016: Q85.B 22.96,60.04 R123.2
N$132
  Top 0.61: C51.2 19.5,71.5 20.74,72.74 24.13,72.74 24.14,72.75 | IC6.2 24.14,72.75 | 24.14,72.75 24.14,73.86 R128.2
  Top 1.016: R128.2 R127.1 26.47,74.03 C53.2
N$133
  Top 0.61: IC6.3 22.86,69.64 23.25,69.25 27.88,69.25 28.08,69.45 | C49.1 33.95,69.45 34.63,70.14 D17.6 34.63,73.11 36.52,75 Q91.G
  Top 1.016: C47.1 28.08,69.45 C49.1 | Q91.G 41.5,75.5 R125.1
N$134
  Top 1.016: Q91.S 41.04,72.5 R125.2
N$135
  Top 0.61: IC5.3 172.87,70.36 172.45,69.95 C50.2 | D18.4 161.59,70.41 | 168.08,69.95 162.05,69.95 161.59,70.41 | Q92.D 160.04,71.96 161.59,70.41
  Top 1.016: C48.2 168.08,69.95 C50.2
N$136
  Top 0.61: 153.54,77.04 R126.2
  Top 1.016: Q92.S 153.54,77.04
N$137
  Top 0.61: IC5.2 174.13,73.64 R130.2
  Top 1.016: C54.1 175,76.97 R130.2 R129.1 177,74 C52.2
N$138
  Top 0.813: R132.2 LED18.C
N$139
  Top 1.016: LED17.A R131.1
N$140
  Bottom 0.813: C1.2 R133.1
N$141
  cutout Top (no thermals): 184.5,14.5 186,13 190.75,17.75 189.25,19.25
  cutout Top (no thermals): 14.62,12.38 16.12,13.88 11.5,18.5 10,17
N$143
  Top 0.61: U$1.6 9.05,12.45 8.98,12.45 C63.1 | U$1.6
N$157
  Top 0.254: U$2.11 28,7.83 28,6.23 Q98.4
N$159
  Top 0.813: R86.1 Q52.E
N$160
  Top 0.813: D11.A 143.7,46.66 Q56.B
  Bottom 0.813: Q52.C 144.54,44.96 Q56.B
N$161
  Top 0.813: D7.C D8.A
N$162
  Top 0.813: D8.C 147.46,43.16 Q52.B 147.46,38.96 146,37.5 138,37.5 137,38.5 R85.2
N$163
  Top 0.813: R87.2 135.5,49 140.3,44.2 D11.C 144.3,39.5 Q57.B
N$164
  Bottom 0.813: Q56.E 139.46,45.54 142,43 Q57.C
N$165
  Bottom 0.813: Q54.C 134.5,41 R91.2 138.46,40.5 Q57.E
N$166
  Bottom 0.813: R92.2 128,41.5 R95.2 | R91.1 131,41.5 R95.2 | R95.2 R98.1
N$167
  Bottom 0.813: R92.1 124.5,41 Q53.C 122.5,47 Q58.E
N$168
  Top 0.813: D12.A 116.2,45.76 Q58.B
  Bottom 0.813: R88.1 124,49 123,50 117.96,50 Q58.B
N$169
  Top 0.813: D12.C 114.96,41.34 Q59.B
  Bottom 0.813: Q55.C 109.5,41 110.5,42 112.46,42 Q59.B
N$170
  Top 0.813: Q55.E R89.2
N$171
  Top 0.813: D9.C D10.A
N$172
  Top 0.813: Q58.C 118.5,46 118.5,44 120.04,42.46 Q59.E
N$173
  Top 0.813: Q53.E 125.96,49 R87.1
N$174
  Bottom 0.813: R88.2 133.04,49 Q54.E
N$175
  Top 0.813: 129.5,42 R83.1 C27.1 | 129.5,42 R84.2 | Q54.B 129.5,45 | 129.5,45 Q53.B | 129.5,45 129.5,42
N$176
  Bottom 0.813: Q60.C 149.5,49 148.5,50 143,50 | 143,50 142,49 Q56.C | Q63.B 142.46,50 143,50
N$177
  Top 0.813: Q60.B Q62.B | Q62.C Q62.B | Q63.E Q62.B
N$178
  Top 0.813: R90.1 Q60.E
N$179
  Top 0.813: Q62.E 154,53 | 154,53 R94.1 | LED11.A 154.25,53.25 154,53
N$180
  Bottom 0.813: Q63.C 142,56.79 Q66.E
N$181
  Top 0.813: R97.2 146.5,54.5 146.79,54.79 Q66.B 147.29,57.5 LED11.C
N$182
  Top 0.813: Q61.B Q65.B | Q65.C Q65.B | Q65.B Q64.E
N$184  (via drill 0.35)
  Top 0.254: U$2.6 25.38,12.92 v25.48,13.02
  Bottom 0.254: v25.48,13.02 26.48,13.02 27.5,12 33.58,12 Q100.4
  other vias: 33.91,11.68
N$188  (via drill 0.35)
  Top 0.254: U$2.2 27.98,13.16 v28,13.19
  Bottom 0.254: v28,13.19 28,17.58 Q97.4
  other vias: 28.32,17.91
N$189  (via drill 0.35)
  Top 0.254: Q99.4 30,8.42 v30,9.5 | v26,11.36 26,12.14 U$2.5
  Bottom 0.254: v30,9.5 28.14,11.36 v26,11.36
N$201
  Top 0.254: 170.18,14.5 Q106.4
  Top 0.406: U$4.11 171.03,13.47 170.18,14.32 170.18,14.5
N$204  (via drill 0.35)
  Top 0.406: U$4.6 173.62,7.58 v173.48,7.43
  Bottom 0.406: v173.48,7.43 172.57,7.43 171.18,8.82 Q108.4
  other vias: 164.59,8.82
N$208  (via drill 0.35)
  Top 0.406: U$4.2 171.03,7.53 v171,7.5
  Bottom 0.406: v171,7.5 171,3.42 v170.18,2.6
N$209  (via drill 0.35)
  Top 0.406: U$4.5 172.52,8.79 v172.52,9.02
  Bottom 0.406: v172.52,9.02 172.27,9.02 171.91,9.38 171.2,9.38 Q107.4
  other vias: 168.41,12.18
N$231
  Top 0.813: Q65.E R96.2 104.75,53.75 LED12.C
N$232
  Top 0.813: R93.2 104.5,47 Q61.E
N$233
  Bottom 0.813: Q59.C 117.5,41.5 113.5,45.5 112,45.5 110.5,47 Q61.C 110,49.5 111.88,51.38 119.14,51.38 120.04,52.29 Q64.B
N$234
  Bottom 0.813: Q67.E 117.5,56.29 Q64.C
N$235
  Top 0.813: R97.1 114.71,54.5 Q67.B LED12.A
N$236
  Top 0.813: R107.1 133.5,58.95 C29.2 132.55,60 C28.1 133.5,60 134.5,61 138,61 139.04,62.04 Q73.B 141,62.5 | Q70.C 146.5,64.5 143,64.5 141,62.5 | Q66.C 144.5,59 141,62.5
  Bottom 0.813: Q73.B 141,62.5 141,68.5 139,70.5 134.5,70.5 | 134.5,70.5 134.5,79 133,80.5 130.5,80.5 129.5,81.5 Q72.C | R105.2 134.5,70.5
N$237
  Bottom 0.813: R100.2 144,62.5 Q68.B | Q68.C Q68.B | Q68.B Q70.B
N$238
  Top 0.813: Q69.C Q69.B Q71.B
  Bottom 0.813: R101.1 118,60.5 114,60.5 112.04,62.46 Q69.B
N$239
  Top 0.813: R99.1 Q68.E
N$240
  Top 0.813: R103.1 Q70.E
N$242
  Top 0.813: R102.2 Q69.E
N$243
  Top 0.813: R104.2 Q71.E
N$244
  Bottom 0.813: Q73.E 133.96,63.96 | Q75.B 139.04,66.04 138,65 135,65 133.96,63.96 | 133.96,63.96 133.92,64 R109.2
N$245
  Bottom 0.813: Q76.B 120.46,62.5 | 120.46,62.5 Q74.E | R109.1 125.5,61.5 121.46,61.5 120.46,62.5
N$246  (via drill 0.35)
  Top 0.813: C30.1 125.5,58.95 R108.2 | C28.2 127.1,59 C30.1 | C30.1 125.45,62.01 R106.1 | Q67.C 113.5,60.54 Q74.B | Q72.E 132,81.96 132,80.5 131,79.5 125,79.5 123,77.5 v123,72 122.5,71.5 122.5,67.5 R106.2
  Bottom 0.813: Q74.B 115.46,62.54 113,65 112,65 Q71.C 109.5,68.5 111,70 121,70 v123,72 | R106.1 R106.2
N$247
  Top 0.813: R110.2 Q75.E
  Top 1.27: Q77.B 136.5,79.46 136.5,72.5 133.96,69.96 Q75.E
N$248  (via drill 0.35)
  Top 0.813: R110.1 128,68.5 126,70.5 v125,70.5 | Q76.E 117,71.04 v117,74
  Bottom 0.813: Q76.E 121.04,68 122,68 124.5,70.5 v125,70.5 | v117,74 117,75 115,77 113,77 110.04,79.96 Q78.B
N$249
  Top 2: R112.2 140.3,76.5 147,76.5 149,78.5 149,80.96 Q77.E
N$250  (via drill 0.4)
  Top 0.813: R113.1 119.7,73.55 v119.75,73.5
  Top 2: R113.1 119.7,79.74 Q78.E
N$251
  Bottom 0.508: IC4.2 129.63,55.63 130.5,56.5 133.1,56.5 133.8,55.8
  Bottom 0.813: R111.2 C31.2 133.8,55.8
N$252
  Bottom 0.508: IC4.3 128.37,51.87 R114.2
  Bottom 0.813: R114.2 125.5,51.5 125.4,51.6 C32.2
N$253
  Top 0.813: D9.A 112.04,41.66 Q55.B 114.04,37.5 121.5,37.5 124.5,40.5 R85.1
N$254
  Bottom 0.813: Q72.B 126.96,80.54 128,79.5 131,79.5 132.5,78 132.5,71 128.5,67 R105.1 126.96,68.04 R106.3
N$255
  Bottom 0.508: C31.1 133.6,58 128.5,58 | IC4.6 128.37,58.13 128.5,58 | R101.2 124,58 128.5,58
  Bottom 0.813: C31.1 135,58.4 136.1,59.5 R100.1
OUT+  (via drill 0.35, 0.4)
  Top 0.813: PAD1.P$1 v68.5,51.5
  Top 2: R80.1 72.7,74.7 70,72 PAD1.P$1 66.5,72 64.3,74.2 R81.2
  Bottom 0.813: R66.2 v68.5,51.5 R82.1 | PAD1.P$1 69,71.5 v81,71.5 C1.1
OUT-  (via drill 0.35, 0.4)
  Top 0.813: v129.5,51.5 PAD2.P$1
  Top 2: R112.1 130.2,72 PAD2.P$1 128.8,72 R113.2
  Bottom 0.813: R98.2 v129.5,51.5 R114.1 | PAD2.P$1 128.5,73 121.8,73 120.3,71.5 v118.5,71.5 R133.2
UOUT+  (via drill 0.35)
  Top 0.508: Q6.6 89.5,17.34 89.5,18.5 R11.2 90.25,19 93.5,22.25 v104,22.25 | Q5.6 106.55,18.45 106,19 v105.5,19
  Top 0.813: Q10.B Q9.B 70.96,20 89,20 R11.2
  Bottom 0.508: v105.5,19 105.5,21 104.25,22.25 v104,22.25
  Bottom 0.813: R21.2 67.54,23.71 Q10.B
UOUT-
  Top 0.508: Q5.4 108.45,19.45 | R20.2 108.95,18.95 108.45,19.45 | Q6.4 91.45,18.45 94.25,21.25 106.65,21.25 108.45,19.45
  Top 0.813: R20.2 110,20 127.04,20 Q18.B 129.04,22 Q17.B
  Bottom 0.813: R36.2 128.54,24.71 Q18.B
UV+
  Top 0.813: U$2.9 26.68,5.67 25,4 Q98.TH 23.5,5.28 C57.1 | Q97.5 Q97.6 24.14,16.64 Q97.TH 24.14,15.37 Q97.7 Q97.8
  pour Top (no thermals): 27,1.25 27,7 22,7 22,1.25
  pour Top (no thermals): 27,13 27,19.5 22,19.5 22,13
  pour Top (no thermals): 14.25,16.25 16,18 22,18 22,13.5 17,13.5
  pour Top (no thermals): 23,5 20,5 20,13.5 17.5,13.5 17.5,1.5 23,1.5
UV+IN
  Top 1.016: LED15.A 3,60.5
  Top 2.54: C37.+ 3,47.92 R115.1 3,60.5 R119.1 C58.2 6.54,72.5 10.5,72.5 | 10.5,72.5 12.04,74.04 C42.2 12.79,76.75 D15.C 20.5,78.3 20.5,80 Q89.C | Q87.C 11,72 10.5,72.5
  pour Top (no thermals): 13.75,16.75 15.5,18.5 15.5,33.5 17,35 17,39 16,40 12,40 11.5,39.5 11.5,19
UV-
  pour Top (rank 2, no thermals): 163.5,13 174,13 174,8 163.5,8
  pour Top (no thermals): 179,9.5 186.25,16.75 184.5,18.5 182.5,18.5 177,13 177,9.5
  pour Top (no thermals): 174,13 177,13 177,11 177,10.5 174,10.5
UV-IN
  Top 0.813: Q88.C 186,75.46 | D16.A 177.45,80.05 Q90.C
  Top 1.016: 194.5,64 194.5,63.25 LED16.C
  Top 2.54: 186,75.46 C39.1 188.46,73 191.96,73 C60.1 R122.2 194.5,64 R116.2 194.5,48.25 C38.-
  Bottom 2.54: C39.1 184.96,76.5 179.5,76.5 176.5,79.5 Q90.C
  pour Top (no thermals): 188.5,19 186.75,17.25 185.25,18.75 185.25,31.5 180.75,36 180.75,39.25 182.5,41 184.5,41 188.5,37
V+  (via drill 0.35)
  Top 0.508: 121.62,15.88 LED3.A | v140,22 R38.2
  Top 0.61: C45.2 24.14,64.31 IC6.7 24.14,67.39 v24.25,67.5 | v29.5,72 R127.2
  Top 0.813: Q15.C Q13.C | Q46.C 78,65 79.5,65 85,70.5 | 85,70.5 95.5,70.5 97.5,68.5 R71.2 R67.2 R62.2 R58.2 97.7,47.3 D1.A 97.7,39.7 R54.2 93.54,35.54 C9.1 93.54,33.79 v87.62,27.88 LED5.A 85.75,24.25 83,21.5 R23.2 | 121.5,15.75 R18.2 R5.2 121.5,8.75 | 121.5,15.75 121.62,15.88 | 121.5,8.75 LED1.A | R12.2 121.5,15.75 | Q21.C Q23.C | R1.3 106.04,5 120,5 121.5,6.5 121.5,8.75 | 85,70.5 84.72,70.78 C25.+
  Top 1.016: R127.2 29.53,74.03 C53.1 29.53,78.93 Q89.E | C35.+ 144.75,73.97 144.75,70.5 | 144.75,70.5 144.75,69.25 140.5,65 136.5,65 | Q91.D 41,79.5 38.46,82.04 C55.2 34.5,85.75 | v149,27.5 149,26 | Q17.C 133,14.81 C5.+ 122.31,14.31 R18.2 | R103.2 158.5,68.5 156.54,70.46 156.38,70.46 156.34,70.5 144.75,70.5 | Q73.C 136.5,65 | 136.5,65 Q75.C
  Top 1.27: D15.A 24.05,78.09 Q89.E | R103.2 R99.2 R94.2 R90.2 158.7,47.3 D7.A 158.7,39.7 R86.2 R131.2 158.5,33.96 C11.1 150.54,26 | 150.54,26 149,26 LED7.A | 150.54,26 150.5,25.96 C7.+ C5.+
  Top 4: Q89.E 26.96,83.96 28.75,85.75 34.5,85.75 82.5,85.75 | Q77.C 143.5,84 141.75,85.75 82.5,85.75 | Q50.C 82.5,85.75
  Bottom 0.508: 68.64,61.13 69,61.5 71,61.5 71.41,61.09 C23.1 | 68.64,61.13 68.64,64.64 69,65 75.5,65 | IC2.7 134.19,28.36 C14.2 | 75.5,65 Q48.C | Q46.C 75.5,65 | IC3.7 68.64,61.13 | IC1.7 71.25,28 C3.2 73.55,28.55 74.16,29.16 76.16,29.16 Q15.C
  Bottom 0.61: v24.25,67.5 28.75,72 v29.5,72 | IC4.7 129.63,61.59 C33.1 132.11,61.89 133,61 135.5,61 136.5,62 Q73.C
  Bottom 0.813: v140,22 143.5,25.5 143.5,28 140,28 138.5,29.5 Q23.C 138.5,32 138,32.5 135,32.5 134,31.5 134,30 134.55,29.45 C14.2 | Q15.C 80.12,27.88 v87.62,27.88 | Q9.C 72,24 73.55,25.55 C3.2
  Bottom 1.016: C35.+ 144.72,79.78 Q77.C | C25.+ 82.5,76.22 Q50.C | 143.5,28 148.5,28 v149,27.5
V-  (via drill 0.35)
  Top 0.61: C46.1 171.15,72.05 IC5.4 171.59,74.09 R130.1
  Top 0.813: Q16.C Q14.C | Q74.C Q76.C 115.5,70 115,70 | 100.8,48 D10.C 100.8,39.7 R89.1 101,38.96 104.96,35 C10.2 104.96,33.29 LED8.C 112.25,24.25 114.5,22 R41.1 | 115,70 102.5,70 101,68.5 R104.1 R102.1 R96.1 101,48.2 100.8,48 | Q49.C Q47.C | 39.8,48.3 39.8,48 | 39.8,48 D4.C | R61.1 40,48.2 39.8,48 | R13.1 76.75,16.25 | 76.75,16.25 LED4.C 75.81,15.31 67,15.31 C8.- 65,15.31 Q10.C 65,20 64,19 57.5,19 56.5,20 R26.1 55.19,21.5 C6.- | 76.75,16.25 R19.1 76.75,11.25 LED2.C 76.75,10.75 R7.1 76.75,7.25 78.5,5.5 90,5.5 92.5,8 R1.1 | Q22.C Q24.C | 100.8,48 101,47.8 R93.1 | 115,70 114.78,70.22 C36.-
  Top 1.016: R130.1 172,76.97 C54.2 v169,77 | C46.1 168.45,72.05 166,74.5 Q92.G 156.5,74 R126.1 | R26.1 52.5,21.5 51.25,22.75 LED6.C | C36.- 115.5,74.72 Q78.C
  Top 1.27: D16.C 182.55,80.41 Q90.E | LED6.C 48.46,26 C12.2 40,34.46 R132.1 R57.1 39.8,40.2 D4.C 39.8,48.3 R61.1 R64.1 R70.1 R72.1 40,68 42.5,70.5 48,70.5 | 48,70.5 54,70.5 Q49.C | C26.- 48,72.28 48,70.5
  Bottom 0.508: 57.5,62.5 60.5,59.5 60.5,58 61.5,57 64,57 64.5,56.5 64.5,55.62 | IC4.4 126,55.5 C34.2 125.5,55.62 125.5,56.5 125,57 122.5,57 121.5,58 121.5,59.5 118.5,62.5 | IC1.4 64.45,30.41 | Q16.C 61,29 63.5,29 63.75,29.25 | 63.75,29.25 64.45,29.95 64.45,30.41 | 64,22.5 63.75,22.75 63.75,29.25 | Q24.C 120.5,30 121.5,29 124,29 125.91,30.91 | IC2.4 125.91,30.91 | 64.5,55.62 C24.2 | 64.5,55.62 64.87,55.62 IC3.4 | C4.1 64.5,30.45 64.45,30.41 | C15.1 125.5,31.31 125.91,30.91
  Bottom 0.813: Q10.C 64,22.5 | Q18.C 126,24.5 124.5,26 124.5,28.5 124,29 | Q74.C 118.5,62.5 | Q47.C 57.5,62.5 | C10.2 104.96,33.46 106.42,32 117.5,32 Q22.C | C56.1 163,85
  Bottom 1.016: v169,77 168,77 166,79 166,85.75 163.75,85.75 163,85
  Bottom 1.27: Q51.C 54.5,78.78 C26.-
  Bottom 4: Q51.C 54.5,84 56.25,85.75 115.5,85.75 | Q90.E 182,81.04 182,84 180.25,85.75 166,85.75 115.5,85.75 | Q78.C 115.5,85.75
VS+
  Top 0.61: 10.95,12.55 10,11.6 10,8.5 12,6.5 J1.2 | U$1.7 10.95,12.55 | 10.95,12.55
VS-
  Top 0.61: U$3.7 193,11.4 193,10.5 190,7.5 188,7.5 186,5.5 J2.2

## Text on the board
tPlace: MJL4281A | MJL4302A | MJF15030 | MJL4281A | MJL4302A | MJF15030 | MJL4281A | MJL4302A | 4.7u | 4.7u | DN2540 | GND | DN2540 | GND | 10u | 10u | 0.47 | 0.47 | 0.47 | 0.47 | 1k | 0.1uF | 1uF | 1uF | 1k5 | 2k4 | 1k | 2k4 | 1k5 | .1uF | 47p | 100uF | OUT+ | 100uF | 100uF | Test | OUT- | 100uF | 47p | 5k | Test | 5k | 0.1uF | 0.1F | Bias | O+ | O- | LT1236-10 | OPA828 | OPA828 | LT1236-10 | 100 | 100 | 100 | 100 | 10u | 100 | 220 | 220 | 10u | .1uF | 100 | 0.1F | Bias | 10F | Init | Init | 10uF | 10V | 10V | 10 | 100 | 100 | 100 | 100 | 10 | 10 | KSC2690 | 47u | KSA1220 | KSC2690 | 47u | KSA1220 | 150p | 150p | 150p | 150p | 10k | 1k | 10 | 1k | 10k | 1M | 1M | 1M | 1M | N = KSC1845 / P = KSA992 / D = 1N4148 / RED 1.8V | 68k | 68k | 100 | 100 | 100 | 100 | 10 | 10 | 560 | 560 | 560 | 560 | 200 | 22p | 1k | 20k | 200 | 200 | 22p | 1k | 20k | 200 | 100k | 100k | 10k | 300 | 300 | 300 | 300 | 10k | 10 | 10 | 10 | 10 | 10000uF | 10000uF | 10 | 10 | 10 | 10 | 300 | 300 | 300 | 300 | 20k | IN+ | 20k | IN- | 10 | 10 | 10k | 10k | 10 | 10 | 10 | 10 | INPUT | 10 | 10 | 2k | 2k | 250 | 1k | 1k | 250 | MOS BSC031N06NS3 G | N | 10k | N | 689 | 489 | P | 10k | P | 250 | 250 | 1k | 1k | LT4320 | 10k | 10k | 10k | 250 | 2200uF | 2200uF | 10k | 10k | 2200uF | 2200uF | 1uF / 100V | 250 | 10k | Balanced / Offset | Design by Kevin Gilmore | Current Feedback Amplifier II | Ver 2.1
bPlace: 7k | 7k | 1k | 1k | 5k | 5k | 5k | 5k | 4u | 4u | 4u | 100k | 100k | 100k | 100k | 4u | 10 | 10 | 500 | 500 | 10 | 200 | 10 | 10 | 200 | 10 | 10k | 10k | 4u | 4u | 10k | 10k